# EAGLE design shinobi_pwm (EAGLE 8.6.3)
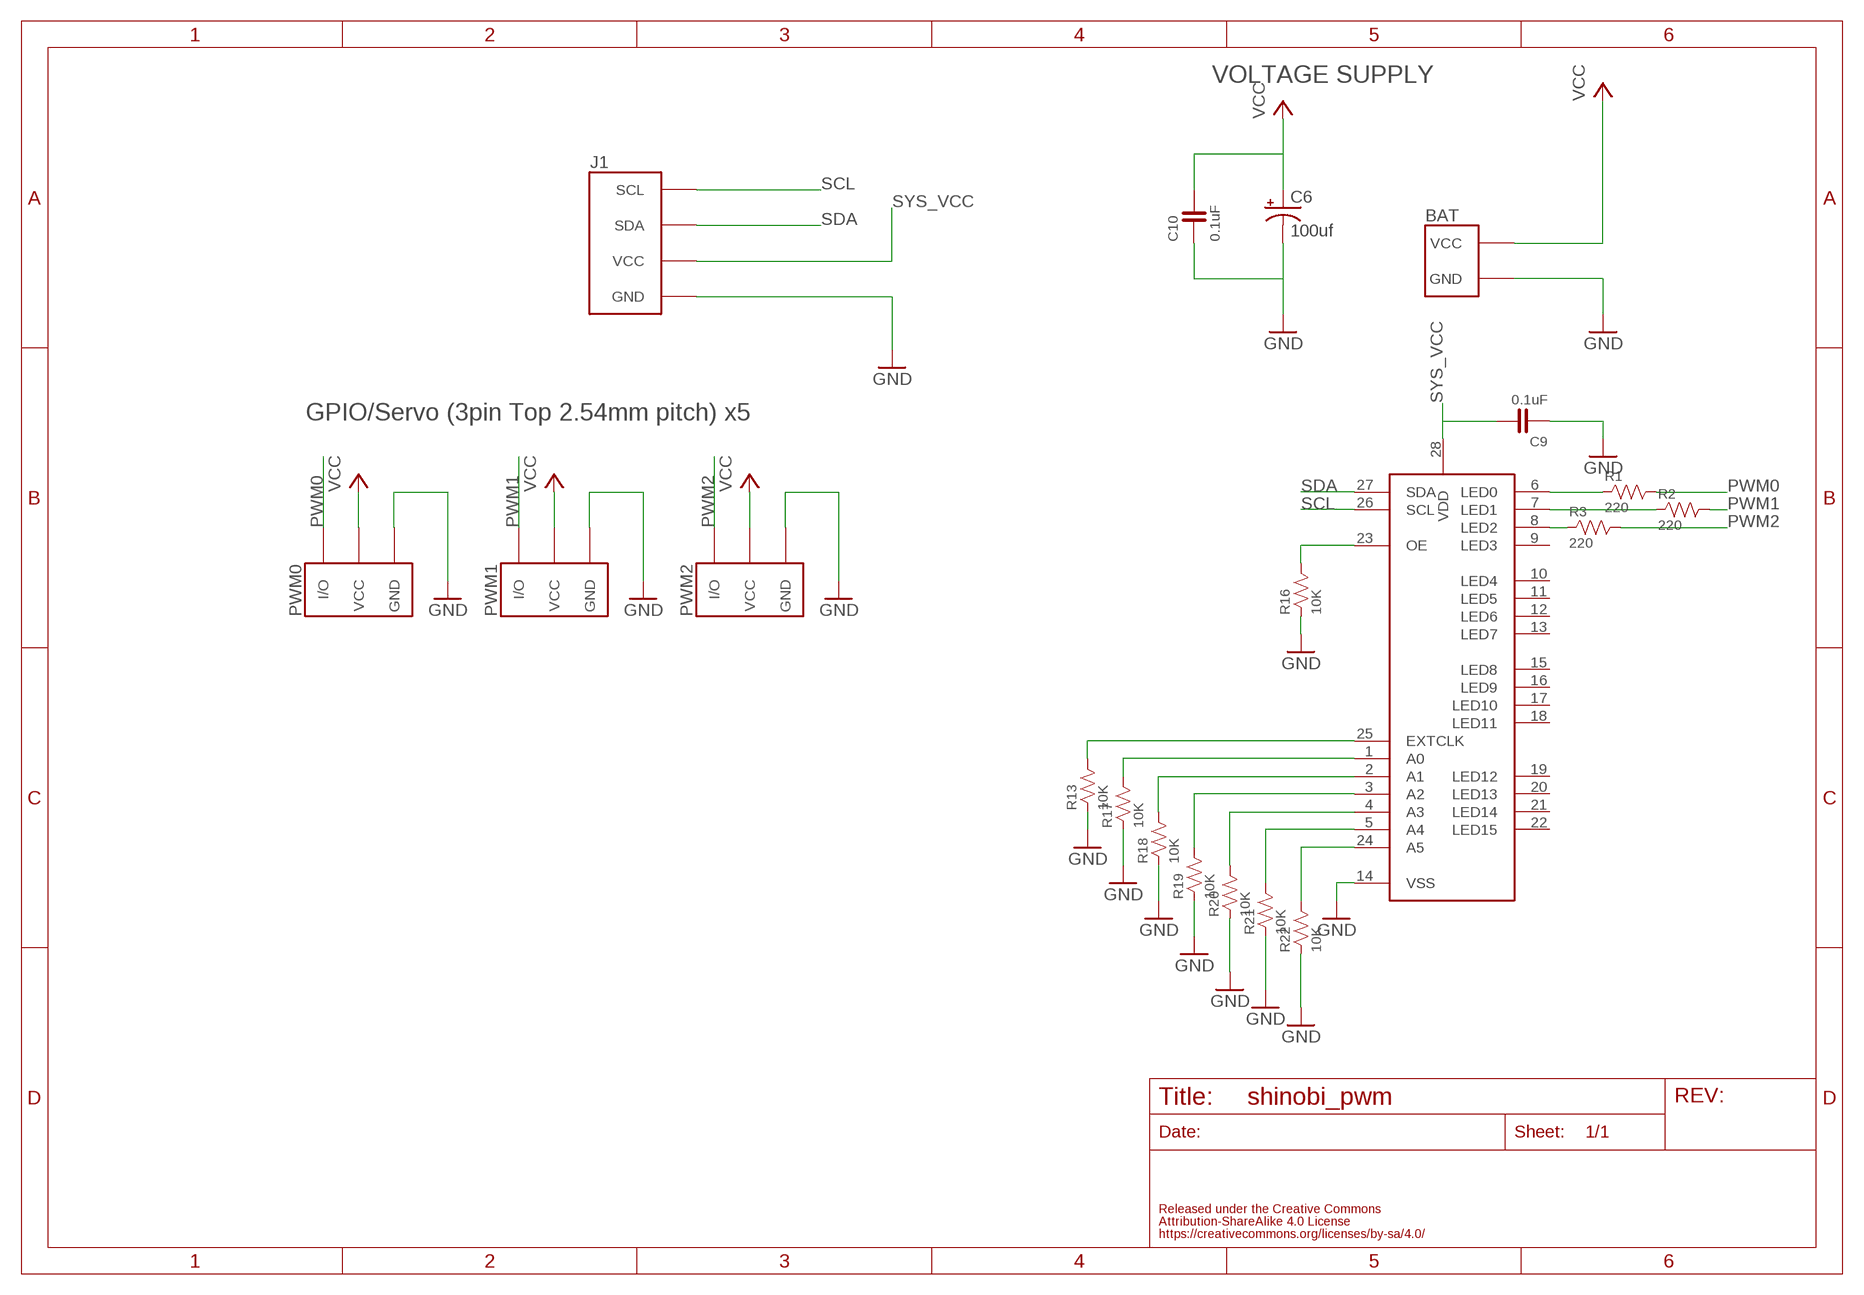
[diagram p0: schematic, sheet 1]

## Parts
BAT  FABO_BRICK_2PIN_SIDE  [FABO_BRICK_2PIN_S02B−PASK-2_SILK]
C6  100uf  CPOL-US153CLV-0405  [153CLV-0405]
C9  0.1uF  CAPACITOR-0603  [0603]
C10  0.1uF  CAPACITOR-0603  [0603]
J1  FABO_BRICK_I2C-S04B-PASK-2_LONG  [FABO_BRICK_I2C_S04B-PASK-2_LONG]
PWM0  FABO_BRICK_3PIN-HEADER  [FABO_BRICK_3PIN_HEADER]
PWM1  FABO_BRICK_3PIN-HEADER  [FABO_BRICK_3PIN_HEADER]
PWM2  FABO_BRICK_3PIN-HEADER  [FABO_BRICK_3PIN_HEADER]
R1  220  RESISTOR-0603  [0603]
R2  220  RESISTOR-0603  [0603]
R3  220  RESISTOR-0603  [0603]
R13  10K  RESISTOR-0402  [0402]
R16  10K  RESISTOR-0603  [0603]
R17  10K  RESISTOR-0603  [0603]
R18  10K  RESISTOR-0603  [0603]
R19  10K  RESISTOR-0603  [0603]
R20  10K  RESISTOR-0603  [0603]
R21  10K  RESISTOR-0603  [0603]
R22  10K  RESISTOR-0402  [0402]
U$9  PCA9685  [PCA9685]

## Nets
GND: BAT.GND C6.- C9.1 C10.1 J1.GND PWM0.GND PWM1.GND PWM2.GND R13.P$1 R16.1 R17.1 R18.1 R19.1 R20.1 R21.1 R22.P$1 U$9.14(VSS)
LED0: R1.1 U$9.6(LED0)
LED1: R2.1 U$9.7(LED1)
LED2: R3.1 U$9.8(LED2)
N$7: R16.2 U$9.23(OE)
N$8: R13.P$2 U$9.25(EXTCLK)
N$9: R17.2 U$9.1(A0)
N$10: R18.2 U$9.2(A1)
N$11: R19.2 U$9.3(A2)
N$12: R20.2 U$9.4(A3)
N$13: R21.2 U$9.5(A4)
N$14: R22.P$2 U$9.24(A5)
PWM0: PWM0.I/O R1.2
PWM1: PWM1.I/O R2.2
PWM2: PWM2.I/O R3.2
SCL: J1.SCL U$9.26(SCL)
SDA: J1.SDA U$9.27(SDA)
SYS_VCC: C9.2 J1.VCC U$9.28(VDD)
VCC: BAT.VCC C6.+ C10.2 PWM0.VCC PWM1.VCC PWM2.VCC
Unconnected: U$9.9(LED3) U$9.10(LED4) U$9.11(LED5) U$9.12(LED6) U$9.13(LED7) U$9.15(LED8) U$9.16(LED9) U$9.17(LED10) U$9.18(LED11) U$9.19(LED12) U$9.20(LED13) U$9.21(LED14) U$9.22(LED15)

## Notes on the sheet
- VOLTAGE SUPPLY
- GPIO/Servo (3pin Top 2.54mm pitch) x5

## Library data of the parts
BAT = FaBo-Template:FABO_BRICK_2PIN
C6 = resistor:CPOL-US: POLARIZED CAPACITOR, American symbol
C9 C10 = FaBo-Capacitor:CAPACITOR: CAPACITOR
J1 = FaBo-Template:FABO_BRICK_I2C: FaBo Brick I2C
PWM0 PWM1 PWM2 = FaBo-Template:FABO_BRICK_3PIN: FaBo Brick 3pin
R1-R3 R13 R16-R22 = FaBo-Resistors:RESISTOR: RESISTOR
U$9 = FaBo-Motor:PCA9685

## Board
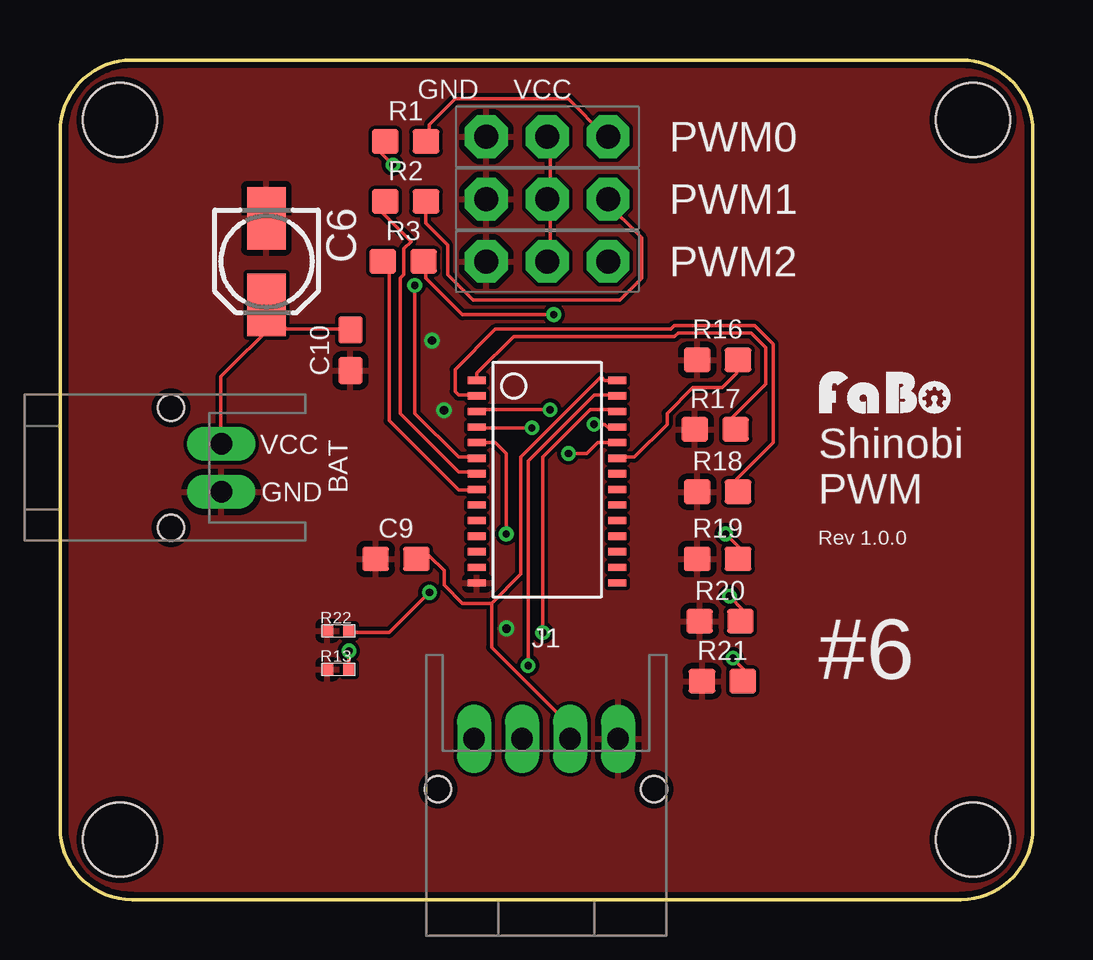
[diagram p1: board, top side]
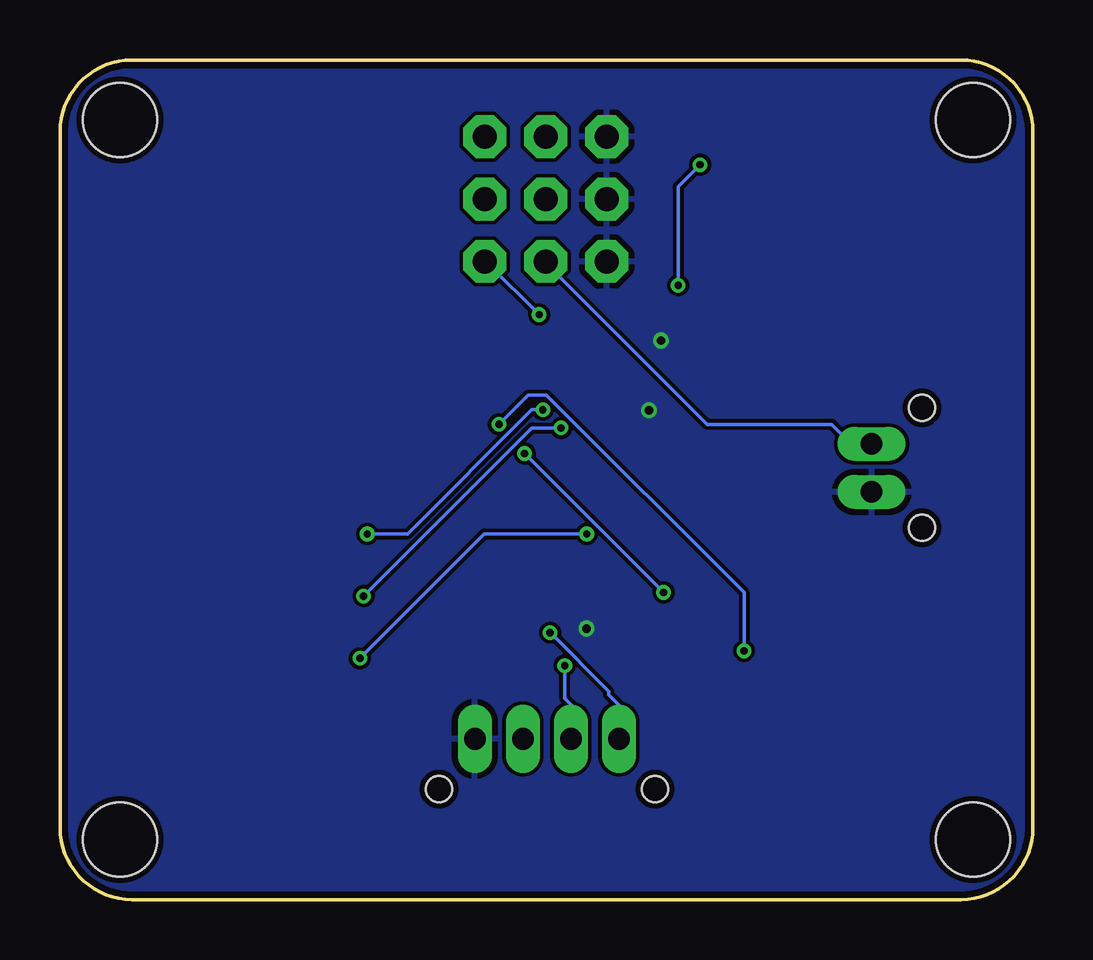
[diagram p2: board, bottom side, seen from below]

Size 40.54 x 35 mm. Coordinates in mm from the lower left corner, seen from the top.
Copper layers (1*16): Top 0.035mm / dielectric 1.5mm / Bottom 0.035mm
Design rules "SeeedStudio_2layer_DRU_no_angle_20140221": minimum track width 6mil, minimum drill 12mil, track to track 6mil, track to pad 6mil, pad to pad 6mil, via to via 6mil, smd to smd 0mil, copper to edge 10mil, drill to drill 10mil, minimum pad ring 10mil, minimum via ring 6mil, stop-mask expansion 2mil, vias tented up to drill 100mil, thermal gap 10mil

### Footprints (pad centres in the part's own frame; a part is rotated, then mirrored left to right if it is on the bottom)
FABO_BRICK_2PIN_S02B−PASK-2_SILK = drill 0.9 pad 1.422 long: GND -1,-0.102; VCC 1,-0.102 | hole 1.1: 2.5,1.998; -2.5,1.998
153CLV-0405 = smd 2.6 x 1.6: + 1.8,0; - -1.8,0
0603 = smd 1.1 x 1: 1 -0.85,0; 2 0.85,0
FABO_BRICK_I2C_S04B-PASK-2_LONG = drill 0.9 pad 1.422 long: GND -3,0; SCL 3,0; SDA 1,0; VCC -1,0 | hole 1.1: 4.5,2.1; -4.5,2.1
FABO_BRICK_3PIN_HEADER = drill 1 pad 1.778 octagon: GND -2.54,0; I/O 2.54,0; VCC 0,0
0402 = smd 0.5 x 0.5: P$1 -0.46,0; P$2 0.46,0
FABO-SHINOBI = hole 3.1: 2.5,32.5; 38.04,32.5; 38.04,2.5; 2.5,2.5
PCA9685 = smd 0.3 x 0.75: 1 -4.15,-2.93; 2 -3.5,-2.93; 3 -2.85,-2.93; 4 -2.2,-2.93; 5 -1.55,-2.93; 6 -0.9,-2.93; 7 -0.25,-2.93; 8 0.4,-2.93; 9 1.05,-2.93; 10 1.7,-2.93; 11 2.35,-2.93; 12 3,-2.93; 13 3.65,-2.93; 14 4.3,-2.93; 15 4.3,2.92; 16 3.65,2.92; 17 3,2.92; 18 2.35,2.92; 19 1.7,2.92; 20 1.05,2.92; 21 0.4,2.92; 22 -0.25,2.92; 23 -0.9,2.92; 24 -1.55,2.92; 25 -2.2,2.92; 26 -2.85,2.92; 27 -3.5,2.92; 28 -4.15,2.92

### Placement (x,y rotation side)
BAT  6.62,18 90 top
C6  8.6,26.6 270 top
C9  14,14.2 0 top
C10  12.1,22.9 90 top
J1  20.25,6.7 180 top
PWM0  20.3,31.8 0 top
PWM1  20.3,29.2 0 top
PWM2  20.3,26.6 0 top
R1  14.4,31.6 0 top
R2  14.4,29.1 0 top
R3  14.3,26.6 0 top
R13  11.6,9.6 0 top
R16  27.4,22.5 0 top
R17  27.3,19.6 0 top
R18  27.4,17 0 top
R19  27.4,14.2 0 top
R20  27.5,11.6 0 top
R21  27.6,9.1 0 top
R22  11.6,11.2 0 top
U$1  [FABO-SHINOBI]  0,0 0 top
U$2  [LOGO_FABO_S]  34.43,20.12 0 top
U$9  20.3,17.5 270 top

### Tracks (layer width: path | path; a pad name or v marks a point on that pad's centre or on a via)
GND  (via drill 0.35)
  other vias: 18.6,11.3 15.5,23.3 16,20.4
  pour Bottom: 0,0 41,0 41,35 0,35
  pour Top: 0,0 41,0 41,35 0,35
LED0  (via drill 0.3)
  Top 0.152: v14.78,25.6 14.78,20.27 16.61,18.44 17.22,18.44 U$9.6 | v13.87,30.63 13.41,31.09 13.41,31.55 R1.1
  Bottom 0.152: v14.78,25.6 14.78,29.72 v13.87,30.63
LED1
  Top 0.152: U$9.7 17.22,17.83 16.61,17.83 14.17,20.27 14.17,25.91 14.33,26.06 14.33,27.13 14.63,27.43 13.41,28.65 13.41,28.96 R2.1
LED2
  Top 0.152: U$9.8 17.22,17.07 16.61,17.07 13.72,19.96 13.72,26.36 13.56,26.52 R3.1
N$7
  Top 0.152: U$9.23 23.32,18.44 23.93,18.44 25.3,19.81 25.3,20.27 26.36,21.34 27.58,21.34 28.19,21.95 28.19,22.4 R16.2
N$8  (via drill 0.3)
  Top 0.152: v12.04,10.36 12.04,9.6 R13.P$2 | v22.25,19.81 22.71,19.81 22.86,19.66 23.16,19.66 U$9.25
  Bottom 0.152: v12.04,10.36 12.04,12.8 20.27,21.03 21.03,21.03 v22.25,19.81
N$9
  Top 0.152: U$9.1 17.37,21.79 17.37,21.95 18.9,23.47 25.6,23.47 25.76,23.62 28.8,23.62 29.41,23.01 29.41,21.49 28.04,20.12 28.04,19.66 R17.2
N$10
  Top 0.152: U$9.2 17.22,21.03 16.61,21.03 16.46,21.18 16.46,22.1 18.14,23.77 25.45,23.77 25.6,23.93 28.96,23.93 29.72,23.16 29.72,19.05 28.19,17.53 28.19,17.07 R18.2
N$11  (via drill 0.3)
  Top 0.152: v20.42,20.42 17.37,20.42 U$9.3 | v27.74,15.24 28.35,14.63 28.35,14.33 R19.2
  Bottom 0.152: v20.42,20.42 20.88,20.42 26.06,15.24 v27.74,15.24
N$12  (via drill 0.3)
  Top 0.152: v19.66,19.66 17.37,19.66 U$9.4 | v27.89,12.65 28.5,12.04 28.5,11.73 R20.2
  Bottom 0.152: v19.66,19.66 20.88,19.66 v27.89,12.65
N$13  (via drill 0.3)
  Top 0.152: U$9.5 18.14,19.05 18.59,18.59 v18.59,15.24 | v28.04,10.06 28.5,9.6 28.5,9.14 R21.2
  Bottom 0.152: v18.59,15.24 22.86,15.24 v28.04,10.06
N$14  (via drill 0.3)
  Top 0.152: v15.39,12.8 13.72,11.12 12.19,11.12 R22.P$2 | v21.18,18.59 21.95,18.59 22.4,19.05 U$9.24
  Bottom 0.152: v21.18,18.59 v15.39,12.8
PWM0
  Top 0.152: R1.2 15.39,31.7 15.39,32.31 16.46,33.38 21.18,33.38 22.71,31.85 PWM0.I/O
PWM1
  Top 0.152: R2.2 15.24,28.96 15.24,28.19 16.15,27.28 16.15,26.06 17.22,24.99 23.32,24.99 24.23,25.91 24.23,27.58 22.71,29.11 PWM1.I/O
PWM2  (via drill 0.3)
  Top 0.152: v20.57,24.38 16.76,24.38 15.24,25.91 15.24,26.52 R3.2
  Bottom 0.152: v20.57,24.38 22.71,26.52 PWM2.I/O
SCL  (via drill 0.3)
  Top 0.152: v20.12,11.12 20.12,18.44 22.1,20.42 23.16,20.42 U$9.26
  Bottom 0.152: v20.12,11.12 17.68,8.69 17.68,8.53 17.22,8.08 17.22,6.71 J1.SCL
SDA  (via drill 0.3)
  Top 0.152: v19.51,9.75 19.51,18.29 22.25,21.03 23.16,21.03 U$9.27
  Bottom 0.152: v19.51,9.75 19.51,8.38 19.2,8.08 19.2,6.71 J1.SDA
SYS_VCC
  Top 0.152: 17.98,12.34 19.2,13.56 19.2,18.44 22.55,21.79 22.71,21.64 23.16,21.64 U$9.28 | 17.98,12.34 16.76,12.34 16,13.11 16,13.72 15.39,14.33 14.94,14.33 C9.2 | 17.98,12.34 17.98,10.52 21.18,7.32 21.18,6.71 J1.VCC
VCC
  Top 0.152: PWM2.VCC 20.42,26.67 20.42,29.11 PWM1.VCC 20.42,29.26 20.42,31.7 PWM0.VCC | 8.99,24.23 8.53,24.69 C6.+ 8.99,24.23 | 8.99,24.23 9.45,23.77 12.04,23.77 C10.2 | 8.99,24.23 8.99,24.08 6.71,21.79 6.71,19.05 BAT.VCC
  Bottom 0.152: PWM2.VCC 20.27,26.52 13.56,19.81 8.38,19.81 7.62,19.05 6.86,19.05 BAT.VCC

### Text on the board
tPlace: GND | VCC | Shinobi | PWM | Rev 1.0.0 | #6